# Altium project PIR_PCB_Project.PrjPcb
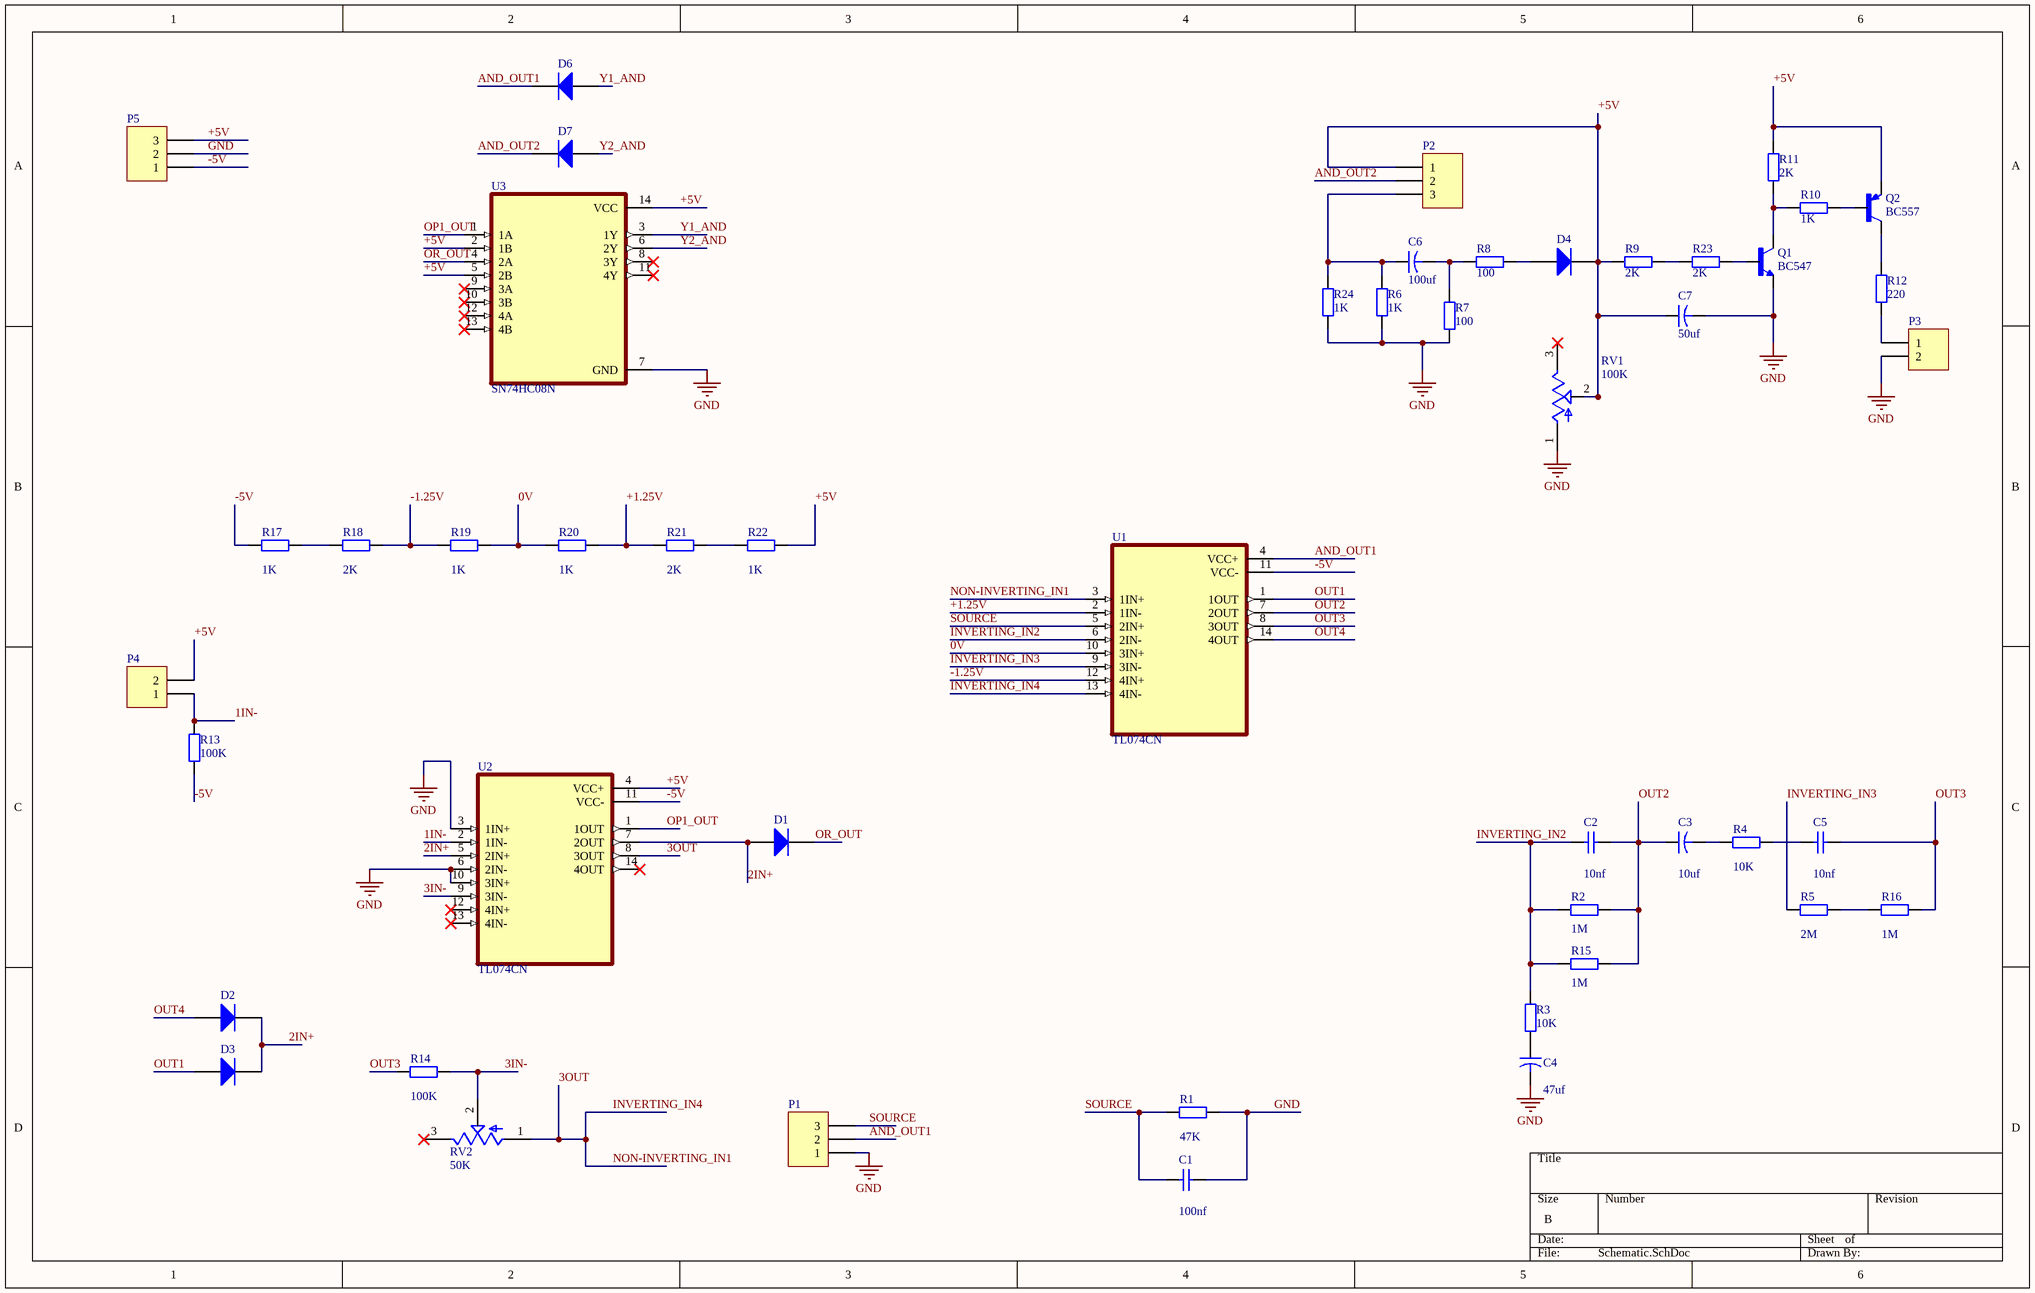
[diagram p0: Schematic.SchDoc]
1 sheet, 49 parts. Net scope: global (net labels, ports and power ports of the same name join across sheets).
Board file: PCB_of_Schematic.PcbDoc

## Sheet Schematic.SchDoc
size B; SheetNumber: 1; SheetTotal: 1

### Parts
C1  value 100nf  [RAD-0.3]  (hidden comment: Cap)
C2  value 10nf  [RAD-0.3]  (hidden comment: Cap)
C3  value 10uf  [CAPR5-4X5]  (hidden comment: Cap2)
C4  value 47uf  [CAPR5-4X5]  (hidden comment: Cap2)
C5  value 10nf  [RAD-0.3]  (hidden comment: Cap)
C6  value 100uf  [CAPR5-4X5]  (hidden comment: Cap2)
C7  value 50uf  [CAPR5-4X5]  (hidden comment: Cap2)
D1  Diode 1N4007  [DO-41]  (value not drawn)
D2  Diode 1N4007  [DO-41]  (value not drawn)
D3  Diode 1N4007  [DO-41]  (value not drawn)
D4  Diode 1N4007  [DO-41]  (value not drawn)
D6  Diode 1N4007  [DO-41]  (value not drawn)
D7  Diode 1N4007  [DO-41]  (value not drawn)
P1  Header 3  [HDR1X3]  (value not drawn)
P2  Header 3  [HDR1X3]  (value not drawn)
P3  Header 2  [HDR1X2]  (value not drawn)
P4  Header 2  [HDR1X2]  (value not drawn)
P5  Header 3  [HDR1X3]  (value not drawn)
Q1  BC547  [TO92260P520H877-3]
Q2  BC557  [TO92260P520H933-3]
R1  value 47K  [AXIAL-0.4]  (hidden comment: Res2)
R2  value 1M  [AXIAL-0.4]  (hidden comment: Res2)
R3  value 10K  [AXIAL-0.4]  (hidden comment: Res2)
R4  value 10K  [AXIAL-0.4]  (hidden comment: Res2)
R5  value 2M  [AXIAL-0.4]  (hidden comment: Res2)
R6  value 1K  [AXIAL-0.4]  (hidden comment: Res2)
R7  value 100  [AXIAL-0.4]  (hidden comment: Res2)
R8  value 100  [AXIAL-0.4]  (hidden comment: Res2)
R9  value 2K  [AXIAL-0.4]  (hidden comment: Res2)
R10  value 1K  [AXIAL-0.4]  (hidden comment: Res2)
R11  value 2K  [AXIAL-0.4]  (hidden comment: Res2)
R12  value 220  [AXIAL-0.4]  (hidden comment: Res2)
R13  value 100K  [AXIAL-0.4]  (hidden comment: Res2)
R14  value 100K  [AXIAL-0.4]  (hidden comment: Res2)
R15  value 1M  [AXIAL-0.4]  (hidden comment: Res2)
R16  value 1M  [AXIAL-0.4]  (hidden comment: Res2)
R17  value 1K  [AXIAL-0.4]  (hidden comment: Res2)
R18  value 2K  [AXIAL-0.4]  (hidden comment: Res2)
R19  value 1K  [AXIAL-0.4]  (hidden comment: Res2)
R20  value 1K  [AXIAL-0.4]  (hidden comment: Res2)
R21  value 2K  [AXIAL-0.4]  (hidden comment: Res2)
R22  value 1K  [AXIAL-0.4]  (hidden comment: Res2)
R23  value 2K  [AXIAL-0.4]  (hidden comment: Res2)
R24  value 1K  [AXIAL-0.4]  (hidden comment: Res2)
RV1  value 100K  [TRIM_3362P-1-501]  (hidden comment: 3362P-1-501)
RV2  value 50K  [TRIM_3362P-1-501]  (hidden comment: 3362P-1-501)
U1  TL074CN  [DIP794W45P254L1969H508Q14]
U2  TL074CN  [DIP794W45P254L1969H508Q14]
U3  SN74HC08N  [DIP794W45P254L1969H508Q14]

### Nets
GND: C1.2 C4.2 C7.2 P1.1 P3.2 P5.2 Q1.3(E) R1.2 R6.1 R7.1 R24.1 RV1.1(CCW) U2.3(1IN+) U2.6(2IN-) U2.10(3IN+) U3.7(GND)
0V: R19.2 R20.1 U1.10(3IN+)
1IN-: P4.1 R13.2 U2.2(1IN-)
2IN+: D1.1(A) D2.2(K) D3.2(K) U2.5(2IN+) U2.7(2OUT)
3IN-: R14.2 RV2.2(WIPER) U2.9(3IN-)
3OUT: RV2.1(CCW) U1.3(1IN+) U1.13(4IN-) U2.8(3OUT)  [also labelled INVERTING_IN4, NON-INVERTING_IN1]
+1.25V: R20.2 R21.1 U1.2(1IN-)
+5V: C7.1 D4.2(K) P2.1 P4.2 P5.3 Q2.3(E) R9.2 R11.2 R22.2 RV1.2(WIPER) U2.4(VCC+) U3.2(1B) U3.5(2B) U3.14(VCC)
-1.25V: R18.2 R19.1 U1.12(4IN+)
-5V: P5.1 R13.1 R17.1 U1.11(VCC-) U2.11(VCC-)
AND_OUT1: D6.2(K) P1.2 U1.4(VCC+)
AND_OUT2: D7.2(K) P2.2
INVERTING_IN2: C2.1 R2.1 R3.2 R15.1 U1.6(2IN-)
INVERTING_IN3: R5.1 U1.9(3IN-)
OP1_OUT: U2.1(1OUT) U3.1(1A)
OR_OUT: D1.2(K) U3.4(2A)
OUT1: D3.1(A) U1.1(1OUT)
OUT2: C2.2 C3.1 R2.2 R15.2 U1.7(2OUT)
OUT3: C5.2 R14.1 R16.2 U1.8(3OUT)
OUT4: D2.1(A) U1.14(4OUT)
SOURCE: C1.1 P1.3 R1.1 U1.5(2IN+)
Y1_AND: D6.1(A) U3.3(1Y)
Y2_AND: D7.1(A) U3.6(2Y)
NetC3_2: C3.2 R4.1
NetC4_1: C4.1 R3.1
NetC5_1: C5.1 R4.2
NetC6_1: C6.1 P2.3 R6.2 R24.2
NetC6_2: C6.2 R7.2 R8.2
NetD4_1: D4.1(A) R8.1
NetP3_1: P3.1 R12.1
NetQ1_1: Q1.1(C) R10.2 R11.1
NetQ1_2: Q1.2(B) R23.1
NetQ2_1: Q2.1(C) R12.2
NetQ2_2: Q2.2(B) R10.1
NetR5_2: R5.2 R16.1
NetR9_1: R9.1 R23.2
NetR17_2: R17.2 R18.1
NetR21_2: R21.2 R22.1

Not connected (* = marked no-connect by the designer): RV1 3(CW)*; RV2 3(CW)*; U2 12(4IN+)* 13(4IN-)* 14(4OUT)*; U3 8(3Y)* 9(3A)* 10(3B)* 11(4Y)* 12(4A)* 13(4B)*

### Library data of the parts
C1 C2 C5 = Cap: Capacitor; Published: 8-Jun-2000; LatestRevisionDate: 17-Jul-2002; LatestRevisionNote: Re-released for DXP Platform.; PackageReference: RAD-0.3; Publisher: Altium Limited; PackageDescription: Radial Cap, Thru-Hole; 2 Leads; 0.3 in Pin Spacing
C3 C4 C6 C7 = Cap2: Capacitor; Published: 23-Sep-2002; PackageReference: CAPR5-4X5; Publisher: Altium Limited; PackageDescription: Capacitor; 2 Leads
D1-D4 D6 D7 = Diode 1N4007: 1 Amp General Purpose Rectifier; Published: 8-Jun-2000; LatestRevisionDate: 17-Jul-2002; LatestRevisionNote: Re-released for DXP Platform.; DatasheetVersion: 1998; PackageVersion: Aug-1999; PackageReference: DO-41; Publisher: Altium Limited; PackageDescription: Diode, Axial; Body 5.2 x 2.7 mm (LxDia. max), Lead Dia. 0.86 mm (max); Code_JEDEC: DO-204-AL; ComponentLink1Description: Manufacturer Link; ComponentLink1URL: http://www.fairchildsemi.com/; ComponentLink2Description: Datasheet; ComponentLink2URL: http://www.fairchildsemi.com/ds/1N%2F1N4001.pdf
P1 P2 P5 = Header 3: Header, 3-Pin; LatestRevisionDate: 17-Jul-2002; LatestRevisionNote: Re-released for DXP Platform.; Publisher: Altium Limited
P3 P4 = Header 2: Header, 2-Pin; LatestRevisionDate: 17-Jul-2002; LatestRevisionNote: Re-released for DXP Platform.; Publisher: Altium Limited
Q1 = BC547A: Bipolar _BJT_ Transistor NPN 45V 100mA 300MHz 500mW Through Hole TO-92-3; MF: ON Semiconductor; Value: *; MP: BC547A; Package: TO-92 NXP Semiconductors; SnapEDA_Link: https://www.snapeda.com/parts/BC547A/ON%20Semiconductor/view-part/805861/?ref=snap; Price: None; Availability: Unavailable
Q2 = BC557AZL1G: Bipolar (BJT) Transistor PNP 30V 100mA 150MHz 500mW Through Hole TO-92-3; Package: None; Price: None; Value: *; MP: BC557AZL1G; Availability: Unavailable
R1-R24 = Res2: Resistor; Published: 8-Jun-2000; LatestRevisionDate: 17-Jul-2002; LatestRevisionNote: Re-released for DXP Platform.; PackageReference: AXIAL-0.4; Publisher: Altium Limited; PackageDescription: Axial Device, Thru-Hole; 2 Leads; 0.4 in Pin Spacing
RV1 RV2 = 3362P-1-501: 500 Ohms 0.5W, 1/2W PC Pins Through Hole Trimmer Potentiometer Cermet 1.0 Turn Top Finger Adjustment; MF: Bourns; Purchase-URL: https://pricing.snapeda.com/search/part/3362P-1-501/?ref=eda; MP: 3362P-1-501; Package: 3362P-1 Bourns Inc.; Price: None; Availability: In Stock; SnapEDA_Link: https://www.snapeda.com/parts/3362P-1-501/Bourns/view-part/?ref=snap; Check_prices: https://www.snapeda.com/parts/3362P-1-501/Bourns/view-part/?ref=eda
U1 U2 = TL074CN: Quad Low-Noise JFET-Input General-Purpose Operational Amplifier 14-PDIP 0 to 70; MF: Texas Instruments; SnapEDA_Link: https://www.snapeda.com/parts/TL074CN/Texas%20Instruments/view-part/4796371/?ref=snap; Price: None; Mouser-Purchase-URL: https://snapeda.com/shop?store=Mouser&id=4796371; Package: PDIP-14 Texas Instruments; Availability: Good; Texas_Instruments-Purchase-URL: https://snapeda.com/shop?store=Texas+Instruments&id=4796371; MP: TL074CN; DigiKey-Purchase-URL: https://snapeda.com/shop?store=DigiKey&id=4796371; Value: *
U3 = SN74HC08N: Quadruple 2-input positive-AND gates 14-PDIP -40 to 85; MF: Texas Instruments; Value: *; Availability: Good; SnapEDA_Link: https://www.snapeda.com/parts/SN74HC08N/Texas%20Instruments/view-part/2878259/?ref=snap; Mouser-Purchase-URL: https://snapeda.com/shop?store=Mouser&id=2878259; Package: PDIP-14 Texas Instruments; DigiKey-Purchase-URL: https://snapeda.com/shop?store=DigiKey&id=2878259; MP: SN74HC08N; Arrow_Electronics-Purchase-URL: https://snapeda.com/shop?store=Arrow+Electronics&id=2878259; Price: None; BuyPart: https://www.snapeda.com/parts/SN74HC08N/Texas%20Instruments/view-part/2878259/?ref=eda